# EAGLE design control (EAGLE 6.1)
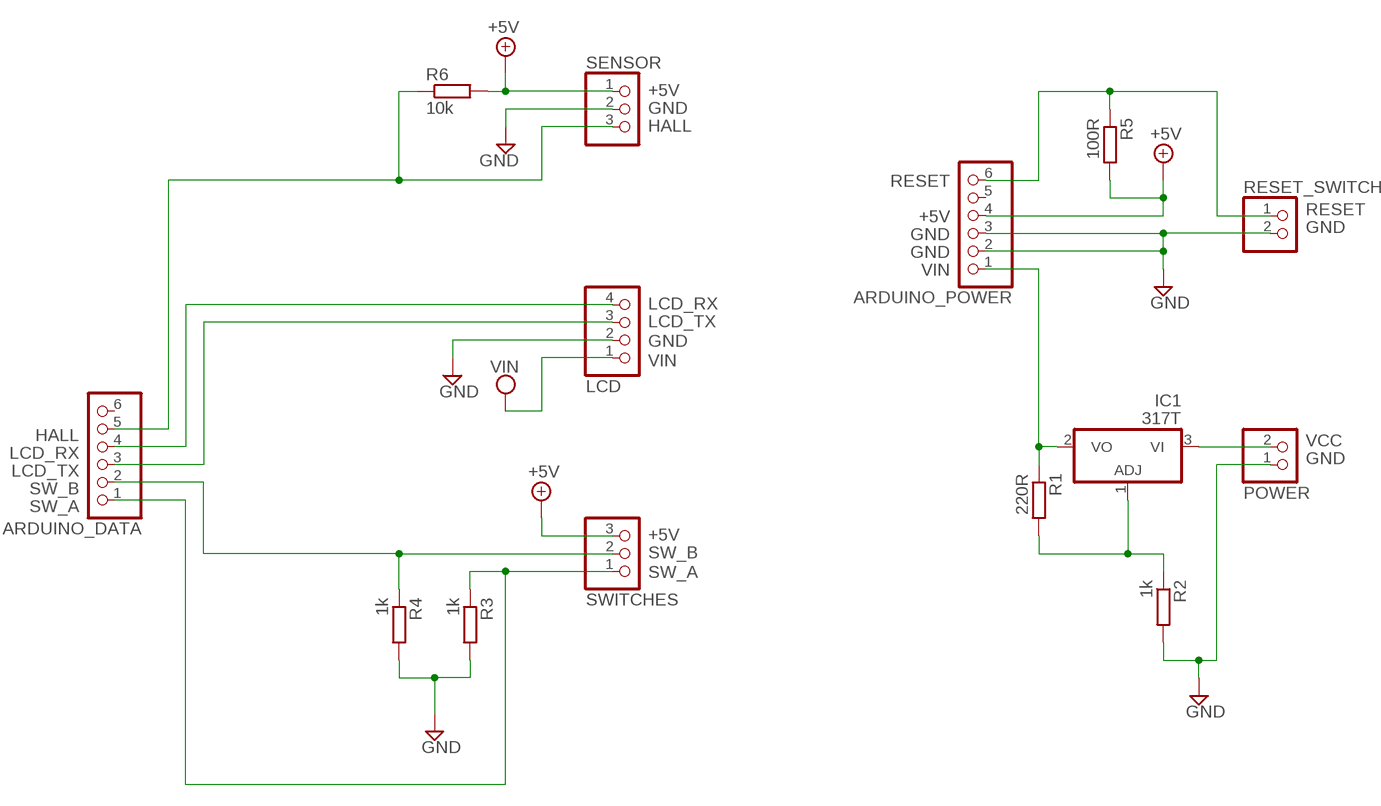
[diagram p0: schematic, sheet 1]

## Parts
ARDUINO_DATA  PINHD-1X6  [1X06]
ARDUINO_POWER  PINHD-1X6  [1X06]
IC1  317T  [TO220H]
LCD  PINHD-1X4  [1X04]
POWER  PINHD-1X2  [1X02]
R1  220R  R-EU_0204/7  [0204/7]
R2  1k  R-EU_0204/7  [0204/7]
R3  1k  R-EU_0207/10  [0207/10]
R4  1k  R-EU_0204/7  [0204/7]
R5  100R  R-EU_0204/7  [0204/7]
R6  10k  R-EU_0207/7  [0207/7]
RESET_SWITCH  PINHD-1X2  [1X02]
SENSOR  PINHD-1X3  [1X03]
SWITCHES  PINHD-1X3  [1X03]

## Nets
+5V: ARDUINO_POWER.4 R5.2 R6.2 SENSOR.1 SWITCHES.3
GND: ARDUINO_POWER.2 ARDUINO_POWER.3 LCD.2 POWER.1 R2.2 R3.2 R4.2 RESET_SWITCH.2 SENSOR.2
HALL: ARDUINO_DATA.5 R6.1 SENSOR.3
LCD_RX: ARDUINO_DATA.4 LCD.4
LCD_TX: ARDUINO_DATA.3 LCD.3
N$5: IC1.1(ADJ) R1.2 R2.1
RESET: ARDUINO_POWER.6 R5.1 RESET_SWITCH.1
SW_A: ARDUINO_DATA.1 R3.1 SWITCHES.1
SW_B: ARDUINO_DATA.2 R4.1 SWITCHES.2
VCC: IC1.3(VI) POWER.2
VIN: ARDUINO_POWER.1 IC1.2(VO) LCD.1 R1.1
Unconnected: ARDUINO_DATA.6 ARDUINO_POWER.5

## Library data of the parts
ARDUINO_DATA ARDUINO_POWER = Rodentometer:PINHD-1X6: PIN HEADER
IC1 = Rodentometer:*317: Positive VOLTAGE REGULATOR
LCD = Rodentometer:PINHD-1X4: PIN HEADER
POWER RESET_SWITCH = Rodentometer:PINHD-1X2: PIN HEADER
R1-R6 = Rodentometer:R-EU_: RESISTOR, European symbol
SENSOR SWITCHES = Rodentometer:PINHD-1X3: PIN HEADER

## Board
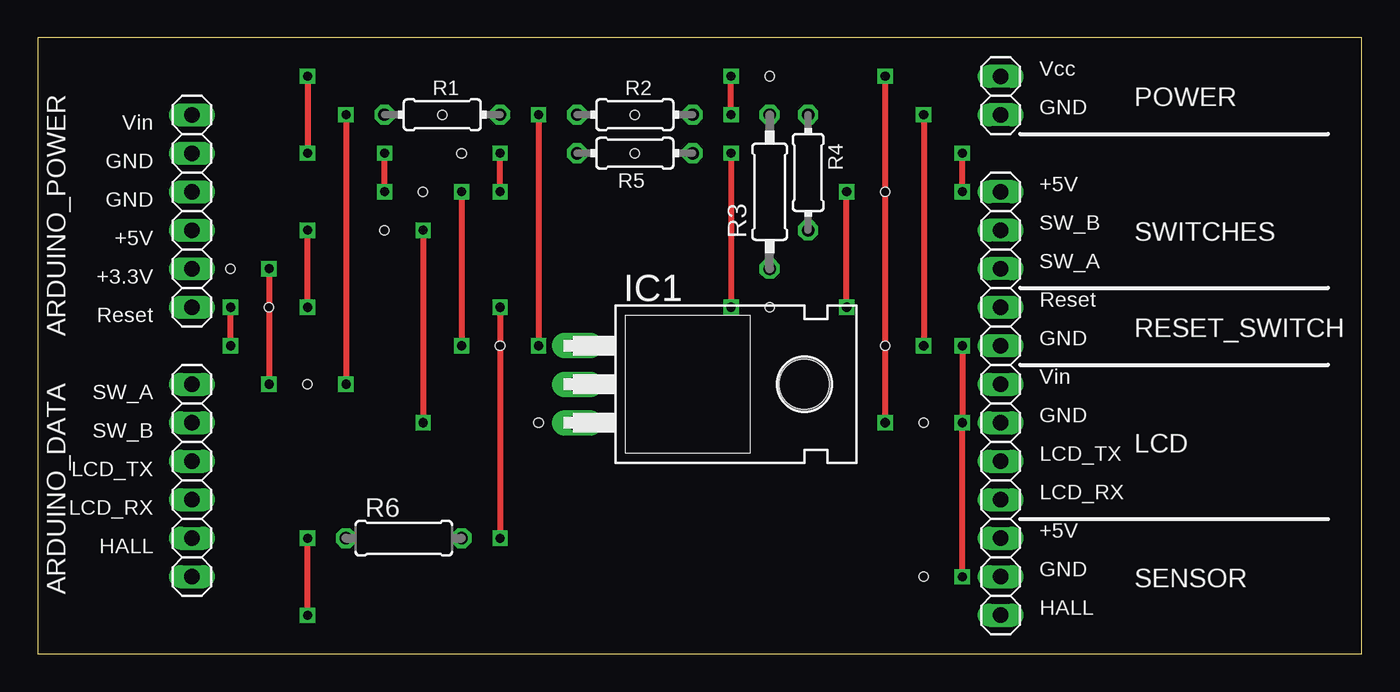
[diagram p1: board, top side]
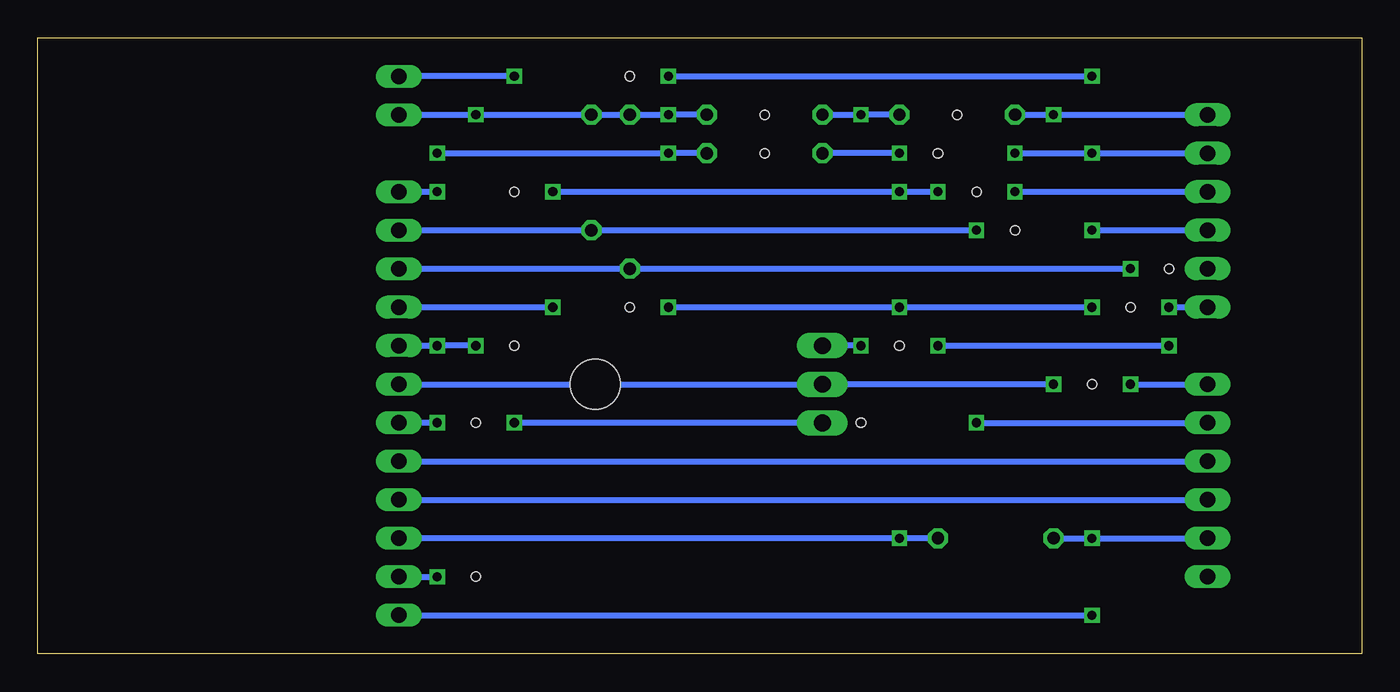
[diagram p2: board, bottom side, seen from below]

Size 87.3 x 40.63 mm. Coordinates in mm from the lower left corner, seen from the top.
Outline: 0,0 87.3,0 87.3,40.63 0,40.63 0,0
Copper layers (1*16): Top 0.035mm / dielectric 1.5mm / Bottom 0.035mm
Design rules: minimum track width 10mil, minimum drill 24mil, track to track 8mil, track to pad 8mil, pad to pad 8mil, via to via 8mil, smd to smd 8mil, copper to edge 40mil, drill to drill 8mil, minimum pad ring 10mil, minimum via ring 8mil, stop-mask expansion 4mil, vias tented up to drill 0mil, thermal gap 10mil
Holes 0.6 mm at 22.86,27.94 27.94,33.02 25.4,30.48 33.02,15.24 17.78,17.78 30.48,20.32 48.26,38.1 58.42,15.24 48.26,22.86 15.24,22.86 55.88,20.32 55.88,30.48 26.67,35.56 39.37,35.56 39.37,33.02 12.7,25.4 58.42,5.08

### Footprints (pad centres in the part's own frame; a part is rotated, then mirrored left to right if it is on the bottom)
1X06 = drill 1.016 long: 1 -6.35,0; 2 -3.81,0; 3 -1.27,0; 4 1.27,0; 5 3.81,0; 6 6.35,0
TO220H = drill 1.118 long: 1 -2.54,-10.16; 2 0,-10.16; 3 2.54,-10.16 | hole 3.302: 0,4.826
1X04 = drill 1.016 long: 1 -3.81,0; 2 -1.27,0; 3 1.27,0; 4 3.81,0
1X02 = drill 1.016 long: 1 -1.27,0; 2 1.27,0
0204/7 = drill 0.813 octagon: 1 -3.81,0; 2 3.81,0
0207/10 = drill 0.813 octagon: 1 -5.08,0; 2 5.08,0
0207/7 = drill 0.813 octagon: 1 -3.81,0; 2 3.81,0
1X03 = drill 1.016 long: 1 -2.54,0; 2 0,0; 3 2.54,0

### Placement (x,y rotation side)
ARDUINO_DATA  10.16,11.43 270 top
ARDUINO_POWER  10.16,29.21 270 top
IC1  45.72,17.78 270 top
LCD  63.5,13.97 270 top
POWER  63.5,36.83 90 top
R1  26.67,35.56 0 top
R2  39.37,35.56 0 top
R3  48.26,30.48 90 top
R4  50.8,31.75 90 top
R5  39.37,33.02 0 top
R6  24.13,7.62 0 top
RESET_SWITCH  63.5,21.59 270 top
SENSOR  63.5,5.08 270 top
SWITCHES  63.5,27.94 90 top

### Tracks (layer width: path | path; a pad name or v marks a point on that pad's centre or on a via)
+5V  (via drill 0.6)
  Top 0.406: v45.72,33.02 v45.72,22.86 | v17.78,22.86 v17.78,27.94 | v30.48,22.86 v30.48,7.62 | v60.96,30.48 v60.96,33.02
  Bottom 0.406: R5.2 v45.72,33.02 v60.96,33.02 | v17.78,22.86 v30.48,22.86 v45.72,22.86 | v17.78,27.94 ARDUINO_POWER.4 | SENSOR.1 v30.48,7.62 R6.2 | SWITCHES.3 v60.96,30.48
GND  (via drill 0.6)
  Top 0.406: v45.72,35.56 v45.72,38.1 | v17.78,38.1 v17.78,33.02 | v22.86,30.48 v22.86,33.02 | v58.42,35.56 v58.42,20.32 | v60.96,20.32 v60.96,15.24 v60.96,5.08
  Bottom 0.406: R2.2 v45.72,35.56 R3.2 R4.2 v58.42,35.56 POWER.1 | v45.72,38.1 v17.78,38.1 | ARDUINO_POWER.2 v22.86,33.02 v17.78,33.02 | v22.86,30.48 ARDUINO_POWER.3 | v58.42,20.32 v60.96,20.32 RESET_SWITCH.2 | v60.96,15.24 LCD.2 | SENSOR.2 v60.96,5.08
HALL  (via drill 0.6)
  Top 0.406: v17.78,2.54 v17.78,7.62
  Bottom 0.406: SENSOR.3 v17.78,2.54 | ARDUINO_DATA.5 v17.78,7.62 R6.1
LCD_RX
  Bottom 0.406: LCD.4 ARDUINO_DATA.4
LCD_TX
  Bottom 0.406: LCD.3 ARDUINO_DATA.3
N$5  (via drill 0.6)
  Top 0.406: v33.02,35.56 v33.02,20.32
  Bottom 0.406: R2.1 v33.02,35.56 R1.2 | v33.02,20.32 IC1.1
RESET  (via drill 0.6)
  Top 0.406: v53.34,22.86 v53.34,30.48 | v30.48,30.48 v30.48,33.02 | v27.94,30.48 v27.94,20.32 | v12.7,20.32 v12.7,22.86
  Bottom 0.406: RESET_SWITCH.1 v53.34,22.86 | v53.34,30.48 v30.48,30.48 v27.94,30.48 | v30.48,33.02 R5.1 | v27.94,20.32 v12.7,20.32 | v12.7,22.86 ARDUINO_POWER.6
SW_A  (via drill 0.6)
  Top 0.406: v15.24,25.4 v15.24,17.78
  Bottom 0.406: SWITCHES.1 R3.1 v15.24,25.4 | v15.24,17.78 ARDUINO_DATA.1
SW_B  (via drill 0.6)
  Top 0.406: v25.4,27.94 v25.4,15.24
  Bottom 0.406: SWITCHES.2 R4.1 v25.4,27.94 | v25.4,15.24 ARDUINO_DATA.2
VCC  (via drill 0.6)
  Top 0.406: v55.88,15.24 v55.88,38.1
  Bottom 0.406: IC1.3 v55.88,15.24 | v55.88,38.1 POWER.2
VIN  (via drill 0.6)
  Top 0.406: v20.32,35.56 v20.32,17.78
  Bottom 0.406: LCD.1 IC1.2 v20.32,17.78 | R1.1 v20.32,35.56 ARDUINO_POWER.1

### Text on the board
tNames: Vcc | Vin | GND | GND | GND | +5V | +5V | SW_B | +3.3V | SW_A | Reset | Reset | GND | SW_A | Vin | SW_B | GND | LCD_TX | LCD_TX | LCD_RX | LCD_RX | HALL | +5V | GND | HALL